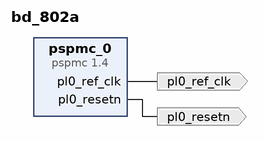
[diagram p0: block diagram of the top level]
# Vivado block design bd_802a, xcvh1582-vsva3697-2MP-e-S, Vivado 2024.2
create_bd_design bd_802a

create_bd_port -dir O -type clk pl0_ref_clk
set_property -dict {CONFIG.FREQ_HZ 99999001} [get_bd_ports pl0_ref_clk]
create_bd_port -dir O -type rst pl0_resetn

create_bd_cell -type ip -vlnv xilinx.com:ip:pspmc:1.4 pspmc_0
